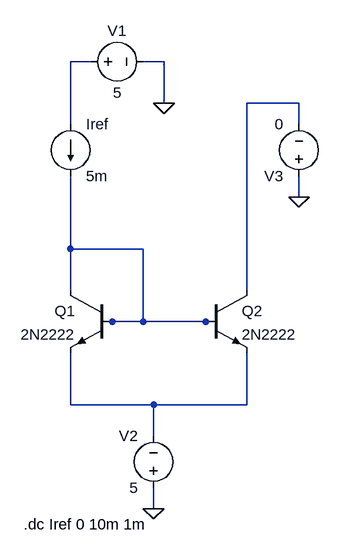
[diagram p0: schematic Experiment 9 - Two transistor current source with BJT.asc]
Experiment 9 - Two transistor current source with BJT.asc, the LTspice schematic file:
Version 4
SHEET 1 880 680
WIRE 128 -192 96 -192
WIRE 240 -192 208 -192
WIRE 240 -128 240 -192
WIRE 448 -128 368 -128
WIRE 96 -96 96 -192
WIRE 448 -96 448 -128
WIRE 448 16 448 -16
WIRE 96 96 96 -16
WIRE 208 96 96 96
WIRE 96 160 96 96
WIRE 368 160 368 -128
WIRE 160 208 144 208
WIRE 208 208 208 96
WIRE 208 208 160 208
WIRE 304 208 208 208
WIRE 320 208 304 208
WIRE 96 336 96 256
WIRE 224 336 96 336
WIRE 368 336 368 256
WIRE 368 336 224 336
WIRE 224 384 224 336
WIRE 224 496 224 464
FLAG 448 16 0
FLAG 240 -128 0
FLAG 224 496 0
SYMBOL npn 160 160 M0
SYMATTR InstName Q1
SYMATTR Value 2N2222
SYMBOL voltage 448 0 R180
WINDOW 123 0 0 Left 0
WINDOW 39 0 0 Left 0
SYMATTR InstName V3
SYMATTR Value 0
SYMBOL current 96 -96 R0
WINDOW 123 0 0 Left 0
WINDOW 39 0 0 Left 0
SYMATTR InstName Iref
SYMATTR Value 5m
SYMBOL npn 304 160 R0
SYMATTR InstName Q2
SYMATTR Value 2N2222
SYMBOL voltage 112 -192 R270
WINDOW 0 32 56 VTop 2
WINDOW 3 -32 56 VBottom 2
WINDOW 123 0 0 Left 0
WINDOW 39 0 0 Left 0
SYMATTR InstName V1
SYMATTR Value 5
SYMBOL voltage 224 480 R180
WINDOW 0 24 96 Left 2
WINDOW 3 24 16 Left 2
WINDOW 123 0 0 Left 0
WINDOW 39 0 0 Left 0
SYMATTR InstName V2
SYMATTR Value 5
TEXT 24 520 Left 2 !.dc Iref 0 10m 1m

The netlist it stands for:
* Experiment 9 - Two transistor current source with BJT.asc
Q1 N003 N003 N004 0 2N2222
V3 0 N002 0
Iref N001 N003 5m
Q2 N002 N003 N004 0 2N2222
V1 N001 0 5
V2 0 N004 5
.model NPN NPN
.model PNP PNP
.lib standard.bjt
.dc Iref 0 10m 1m
.backanno
.end